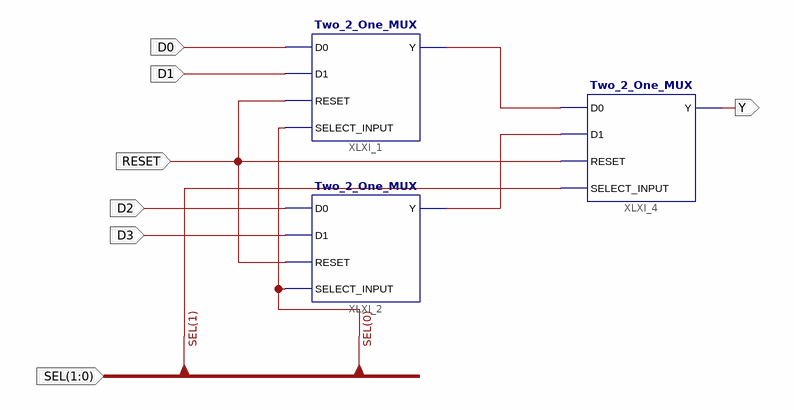
[diagram p0: schematic sheet 1]
// Xilinx ISE schematic Four_2_One_MUX.sch (artix7) as structural Verilog: 3 symbols, 7 ports
module Four_2_One_MUX (
  input  RESET,
  input  D0,
  input  D1,
  input  D2,
  input  D3,
  input  [1:0] SEL,
  output Y
);

  wire XLXN_2, XLXN_3;

  Two_2_One_MUX XLXI_1 (.D0(D0), .D1(D1), .RESET(RESET), .SELECT_INPUT(SEL[0]), .Y(XLXN_2));
  Two_2_One_MUX XLXI_2 (.D0(D2), .D1(D3), .RESET(RESET), .SELECT_INPUT(SEL[0]), .Y(XLXN_3));
  Two_2_One_MUX XLXI_4 (.D0(XLXN_2), .D1(XLXN_3), .RESET(RESET), .SELECT_INPUT(SEL[1]), .Y(Y));
endmodule
